# EAGLE design acromegaly (EAGLE 9.1.0)
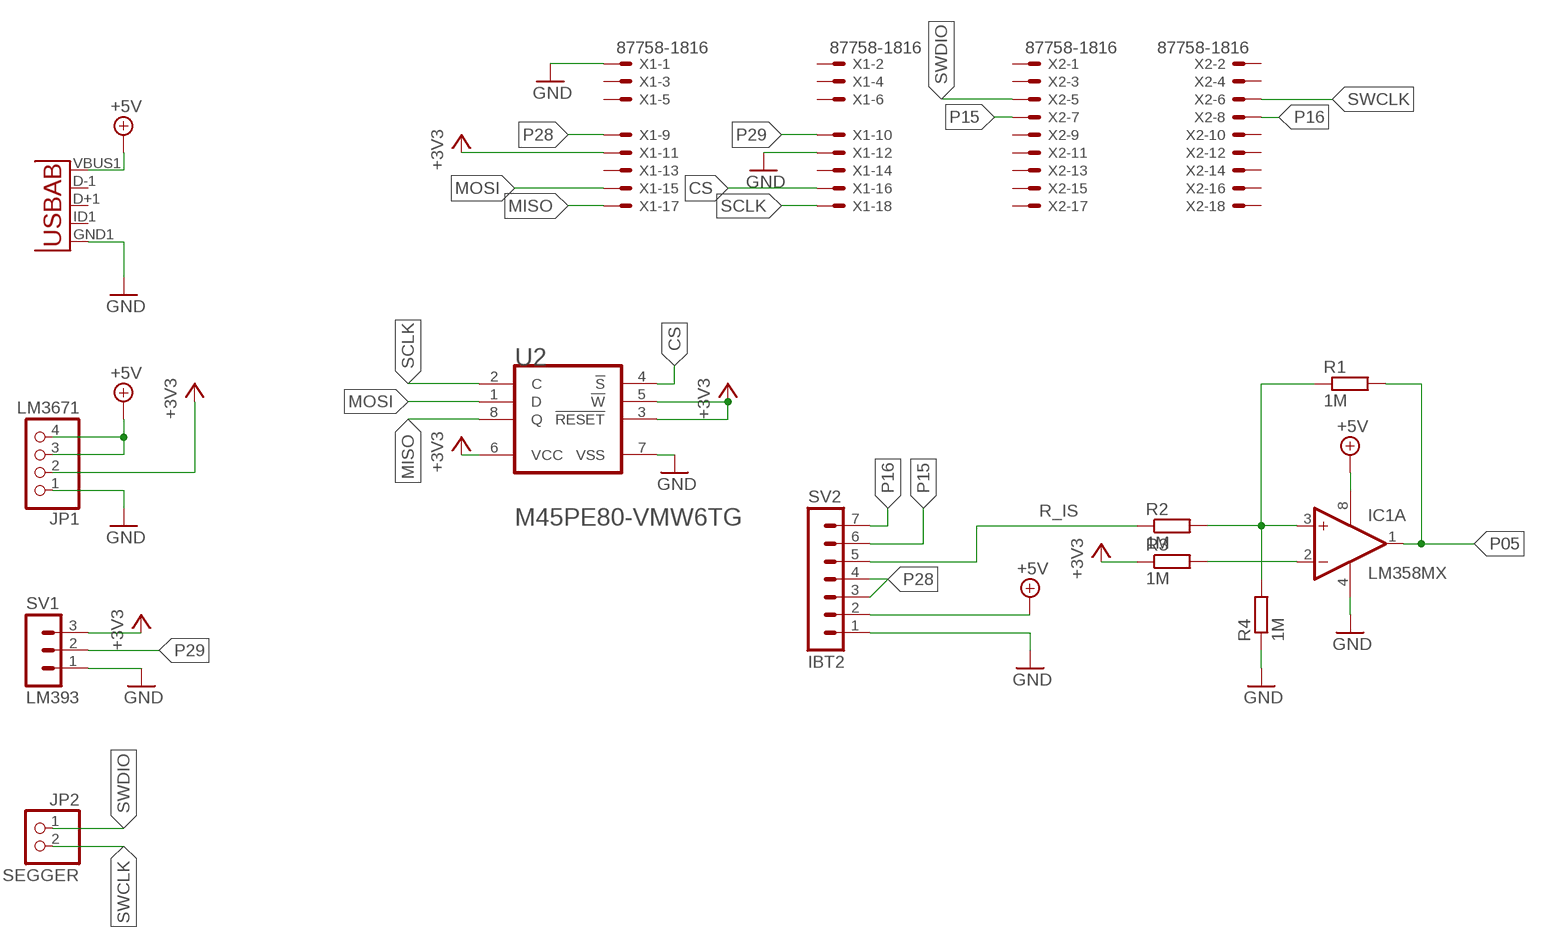
[diagram p0: schematic, sheet 1]

## Parts
IC1  LM358MX  [SO08]
JP1  LM3671  PINHD-1X4  [1X04]
JP2  SEGGER  PINHD-1X2  [1X02]
R1  1M  R-EU_M1206  [M1206]
R2  1M  R-EU_M1206  [M1206]
R3  1M  R-EU_M1206  [M1206]
R4  1M  R-EU_M1206  [M1206]
SV1  LM393  MA03-1  [MA03-1]
SV2  IBT2  MA07-1  [MA07-1]
U1  USB""  [USB-MICRO-SMD]
U2  MICRON_M45PE80-VMW6TGMICRON_M45PE80-VMW6TG_0_0  [MICRON_M45PE80-VMW6TG_0]
X1  87758-1816  [87758-1816]
X2  87758-1816  [87758-1816]

## Nets
+3V3: JP1.2 R3.1 SV1.3 U2.3(!RESET!) U2.5(!W!) U2.6(VCC) X1.11
+5V: IC1.8(P:V+) JP1.3 JP1.4 SV2.2 U1.VBUS1(VBUS)
CS: U2.4(!S!) X1.16
GND: IC1.4(P:V-) JP1.1 R4.1 SV1.1 SV2.1 U1.GND1(GND) U2.7(VSS) X1.1 X1.12
MISO: U2.8(Q) X1.17
MOSI: U2.1(D) X1.15
N$1: IC1.3(A:+IN) R1.1 R2.2 R4.2
N$3: IC1.2(A:-IN) R3.2
P05: IC1.1(A:OUT) R1.2
P15: SV2.6 X2.7
P16: SV2.7 X2.8
P28: SV2.3 SV2.4 X1.9
P29: SV1.2 X1.10
R_IS: R2.1 SV2.5
SCLK: U2.2(C) X1.18
SWCLK: JP2.2 X2.6
SWDIO: JP2.1 X2.5
Unconnected: IC1.5(B:+IN) IC1.6(B:-IN) IC1.7(B:OUT) U1.D+1(D+) U1.D-1(D-) U1.ID1(USBID) X1.2 X1.3 X1.4 X1.5 X1.6 X1.7 X1.8 X1.13 X1.14 X2.1 X2.2 X2.3 X2.4 X2.9 X2.10 X2.11 X2.12 X2.13 X2.14 X2.15 X2.16 X2.17 X2.18

## Library data of the parts
IC1 = linear:LM358: OP AMP also LM158; LM258; LM2904 Source: http://cache.national.com/ds/LM/LM158.pdf
JP1 = pinhead:PINHD-1X4: PIN HEADER
JP2 = pinhead:PINHD-1X2: PIN HEADER
R1-R4 = resistor:R-EU_: RESISTOR, European symbol
SV1 = con-lstb:MA03-1: PIN HEADER; OC_FARNELL: unknown; OC_NEWARK: unknown
SV2 = con-lstb:MA07-1: PIN HEADER; OC_FARNELL: unknown; OC_NEWARK: unknown
U1 = MicroUSB2:USB: This is a USB AB connector that is compatible with USB OTG. i.e. this connector can serve as a host or device
U2 = Micron - M45PE80-VMW6TG:MICRON_M45PE80-VMW6TG: MICT-M45PE80-VMW-8; APPLICATIONS: EmbeddedÂ; CIIVA_IDS: 1411438; COMPONENT_LINK_1_DESCRIPTION: Manufacturer URL; COMPONENT_LINK_1_URL: http://www.micron.com/; COMPONENT_LINK_3_DESCRIPTION: Package Specification; COMPONENT_LINK_3_URL: http://www.micron.com/~/media/Documents/Products/Data%20Sheet/NOR%20Flash/Serial%20NOR/M25P/M25P16.pdf; DATASHEET: http://www.micron.com/~/media/Documents/Products/Data%20Sheet/NOR%20Flash/Serial%20NOR/M25PE_M45PE/M45PE80.pdf; DATASHEET_VERSION: Rev 11; DENSITY: 8MbÂ; FOOTPRINT_VARIANT_NAME_0: Manufacturer Recommended; IMPORTED: yes; IMPORTED_FROM: vault; IMPORT_TS: 1521864873; MF: Micron; MOUNTING_TECHNOLOGY: Surface Mount; MPN: M45PE80-VMW6TG; PACKAGE: SO8 WideA; PACKAGE_DESCRIPTION: 8-Pin SO Wide, 5.62 X 6.05 mm, Pitch 1.27 mm; PACKAGE_VERSION: Rev 8; PART_FAMILY: M45PEÂ; PART_STATUS: ProductionÂ; PREFIX: U; RELEASE_DATE: 1354234387; SPEED: 75 MHzÂ; TYPE: Page EraseÂ; VAULT_GUID: 19A16B9D-C728-4040-9A60-829A5A573E41; VAULT_REVISION: 15243816-01DA-4E28-A0DD-CE2644C948A0; VOLTAGE: 2.7V-3.6VÂ; WIDTH: x1Â
X1 X2 = con-molex:87758-1816: 18 Pin - 2mm Dual Row Single Wafer, Vertical T/H HDR Source: http://www.molex.com/pdm_docs/sd/877580616_sd.pdf; MF: MOLEX; MPN: 87758-1816; OC_FARNELL: unknown; OC_NEWARK: 25M5675

## Net classes
0 default: width 0.5 mm, clearance 0.25 mm

## Board
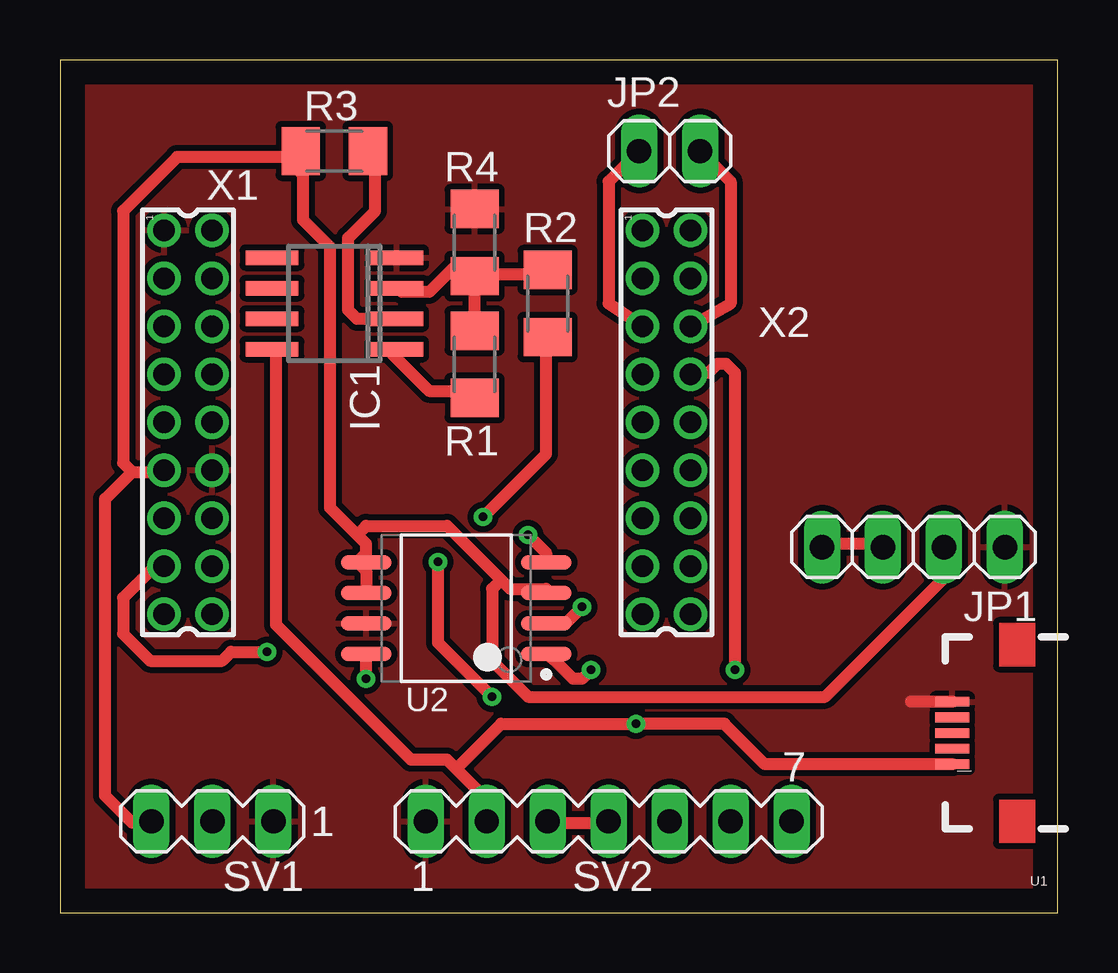
[diagram p1: board, top side]
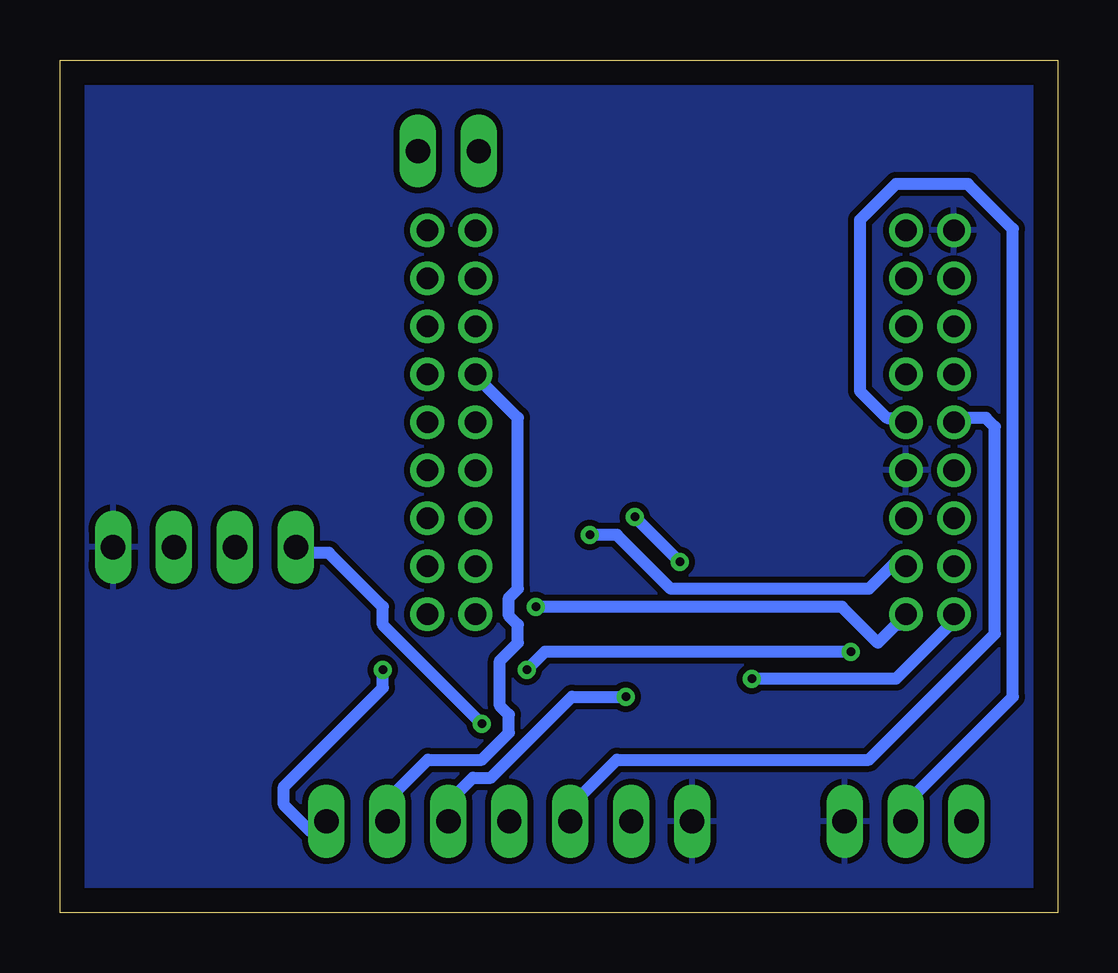
[diagram p2: board, bottom side, seen from below]

Size 41.58 x 35.55 mm. Coordinates in mm from the lower left corner, seen from the top.
Outline: 0,0 41.58,0 41.58,35.55 0,35.55 0,0
Copper layers (1*16): Top 0.035mm / dielectric 1.5mm / Bottom 0.035mm
Design rules "default": minimum track width 6mil, minimum drill 0.35mm, track to track 6mil, track to pad 6mil, pad to pad 6mil, via to via 6mil, smd to smd 6mil, copper to edge 40mil, drill to drill 6mil, minimum pad ring 10mil, minimum via ring 8mil, stop-mask expansion 4mil, vias tented up to drill 0mil, thermal gap 10mil

### Footprints (pad centres in the part's own frame; a part is rotated, then mirrored left to right if it is on the bottom)
SO08 = smd 0.6 x 2.2: 1 -1.905,-2.6; 2 -0.635,-2.6; 3 0.635,-2.6; 4 1.905,-2.6; 5 1.905,2.6; 6 0.635,2.6; 7 -0.635,2.6; 8 -1.905,2.6
1X04 = drill 1.016 long: 1 -3.81,0; 2 -1.27,0; 3 1.27,0; 4 3.81,0
1X02 = drill 1.016 long: 1 -1.27,0; 2 1.27,0
M1206 = smd 1.6 x 2: 1 -1.4,0; 2 1.4,0
MA03-1 = drill 1.016 long: 1 -2.54,0; 2 0,0; 3 2.54,0
MA07-1 = drill 1.016 long: 1 -7.62,0; 2 -5.08,0; 3 -2.54,0; 4 0,0; 5 2.54,0; 6 5.08,0; 7 7.62,0
USB-MICRO-SMD = smd 1.4 x 0.4: D+1 2.7,0; D-1 2.7,0.65; GND1 2.7,-1.3; ID1 2.7,-0.65; VBUS1 2.7,1.3
MICRON_M45PE80-VMW6TG_0 = smd 2.1 x 0.6: 1 -3.75,1.905; 2 -3.75,0.635; 3 -3.75,-0.635; 4 -3.75,-1.905; 5 3.75,-1.905; 6 3.75,-0.635; 7 3.75,0.635; 8 3.75,1.905
87758-1816 = drill 0.9 pad 1.27: 1 -8,-1; 2 -8,1; 3 -6,-1; 4 -6,1; 5 -4,-1; 6 -4,1; 7 -2,-1; 8 -2,1; 9 0,-1; 10 0,1; 11 2,-1; 12 2,1; 13 4,-1; 14 4,1; 15 6,-1; 16 6,1; 17 8,-1; 18 8,1

### Placement (x,y rotation side)
IC1  11.43,25.4 90 top
JP1  35.56,15.24 180 top
JP2  25.4,31.75 0 top
R1  17.27,22.86 270 top
R2  20.32,25.4 90 top
R3  11.43,31.75 0 top
R4  17.27,27.94 270 top
SV1  6.35,3.81 180 top
SV2  22.86,3.81 0 top
U1  39.88,7.49 180 top
U2  16.51,12.7 180 top
X1  5.33,20.45 270 top
X2  25.27,20.45 270 top

### Tracks (layer width: path | path; a pad name or v marks a point on that pad's centre or on a via)
+3V3
  Top 0.5: 3,18.38 4.12,18.38 X1.11 | 3,18.38 1.88,17.25 1.88,4.88 3,3.75 3.75,3.75 SV1.3 | 10.12,30.75 10.12,28.88 11.25,27.75 11.25,16.88 12.38,15.75 | 10.12,30.75 10.12,31.5 R3.1 | 12.38,15.75 12.75,15.38 12.75,15 | 12.75,15 12.75,14.62 U2.5 | 12.75,15 12.38,14.62 12.75,14.25 12.75,13.5 U2.6 | 18.38,13.88 16.12,16.12 12.75,16.12 12.38,15.75 | 18.38,13.88 18.75,13.5 20.25,13.5 U2.3 | 18.38,13.88 18,13.5 18,10.5 19.5,9 31.88,9 36.75,13.88 36.75,15 JP1.2 | 3,18.38 2.62,18.75 2.62,29.25 4.88,31.5 9.38,31.5 10.12,30.75
+5V  (via drill 0.35)
  Top 0.5: JP1.4 31.88,15.38 34.12,15.38 JP1.3 | 16.5,6 17.62,4.88 17.62,4.12 SV2.2 | 16.5,6 16.12,6.38 14.62,6.38 9,12 9,23.25 IC1.8 | 16.5,6 18.38,7.88 v24,7.88 27.68,7.88 29.37,6.19 U1.VBUS1
  Bottom 0.5: v24,7.88 28.12,12 28.12,12.75 30.38,15 31.5,15 JP1.4
CS  (via drill 0.35)
  Top 0.5: v19.5,15.75 20.25,15 20.25,14.62 U2.4
  Bottom 0.5: v19.5,15.75 18.38,15.75 16.12,13.5 7.88,13.5 6.75,14.62 6.38,14.62 X1.16
GND
  Top 0.5: U1.GND1 35.46,8.79
  pour Top: -6.35,35.56 43.18,35.56 43.18,-1.27 -6.35,-1.27
  pour Bottom: -6.35,35.56 43.18,35.56 43.18,-1.27 -6.35,-1.27
MISO  (via drill 0.35)
  Top 0.5: v12.75,9.75 12.75,10.5 U2.8
  Bottom 0.5: v12.75,9.75 6.75,9.75 4.12,12.38 X1.17
MOSI  (via drill 0.35)
  Top 0.5: v22.12,10.12 21.75,9.75 21.38,9.75 20.62,10.5 U2.1 | v8.62,10.88 7.12,10.88 6.75,10.5 3.75,10.5 2.62,11.62 2.62,13.12 4.12,14.62 X1.15
  Bottom 0.5: v22.12,10.12 21.38,10.88 v8.62,10.88
N$1
  Top 0.5: 17.25,26.62 16.88,26.25 17.25,25.88 17.25,24.38 R1.1 | 17.25,26.62 R4.2 | R2.2 20.25,26.62 17.62,26.62 R4.2 | 17.25,26.62 16.88,27 16.5,27 15.38,25.88 14.25,25.88 IC1.3 | 17.25,26.62 R4.2
N$3
  Top 0.5: R3.2 13.12,31.5 13.12,29.25 12,28.12 12,25.12 12.38,24.75 13.88,24.75 IC1.2
P05
  Top 0.5: R1.2 17.25,21.75 15.38,21.75 13.88,23.25 IC1.1
P15
  Bottom 0.5: SV2.6 27.75,4.12 27.75,4.88 26.25,6.38 24,6.38 22.88,7.5 22.88,8.25 23.25,8.62 23.25,10.5 22.5,11.25 22.5,12 22.88,12.38 22.88,13.12 22.5,13.5 22.5,20.62 24,22.12 X2.7
P16  (via drill 0.35)
  Top 0.5: v28.12,10.12 28.12,22.5 27.75,22.88 27.38,22.88 27,22.5 26.62,22.5 X2.8
  Bottom 0.5: v28.12,10.12 28.12,9.38 32.25,5.25 32.25,4.5 31.12,3.38 30.75,3.38 30.38,3.75 SV2.7
P28
  Top 0.5: SV2.4 22.5,3.75 20.62,3.75 SV2.3
  Bottom 0.5: X1.9 4.12,20.62 3,20.62 2.62,20.25 2.62,11.62 7.88,6.38 18.38,6.38 20.62,4.12 SV2.3
P29
  Bottom 0.5: X1.10 6.38,20.62 7.12,20.62 8.25,21.75 8.25,28.88 6.75,30.38 3.75,30.38 1.88,28.5 1.88,9 6,4.88 6,4.12 SV1.2
R_IS  (via drill 0.35)
  Top 0.5: v17.62,16.5 20.25,19.12 20.25,24 R2.1 | v15.75,14.62 15.75,11.25 v18,9
  Bottom 0.5: v15.75,14.62 v17.62,16.5 | v18,9 20.25,9 23.62,5.62 24.38,5.62 25.12,4.88 25.12,4.12 SV2.5
SCLK  (via drill 0.35)
  Top 0.5: v21.75,12.75 21,12 20.62,12 U2.2
  Bottom 0.5: v21.75,12.75 9,12.75 7.5,11.25 6.75,12 6.38,12 6,12.38 X1.18
SWCLK
  Top 0.5: JP2.2 27.94,30.48 27.94,25.4 X2.6
SWDIO
  Top 0.5: JP2.1 22.86,30.48 22.86,25.4 X2.5